# EAGLE design ライン_中央 (EAGLE 9.6.2)
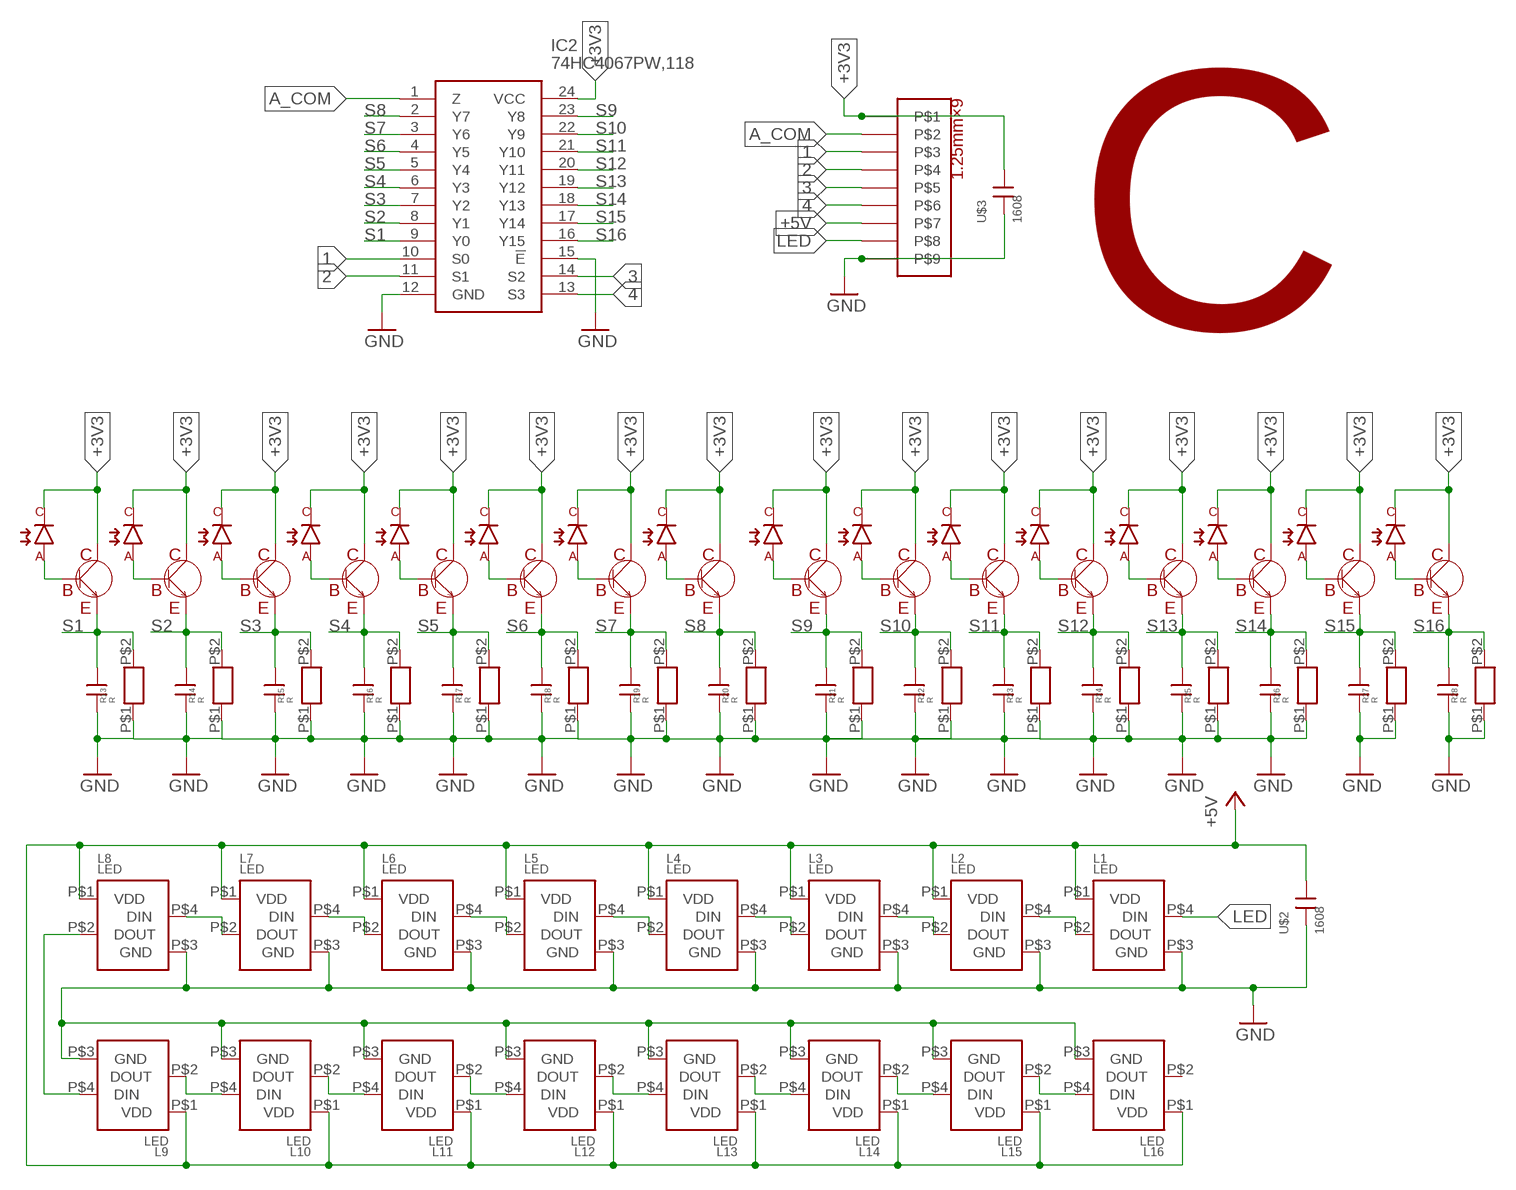
[diagram p0: schematic, sheet 1]

## Parts
C13  1608  [CON]
C14  1608  [CON]
C15  1608  [CON]
C16  1608  [CON]
C17  1608  [CON]
C18  1608  [CON]
C19  1608  [CON]
C20  1608  [CON]
C21  1608  [CON]
C22  1608  [CON]
C23  1608  [CON]
C24  1608  [CON]
C25  1608  [CON]
C26  1608  [CON]
C27  1608  [CON]
C28  1608  [CON]
IC2  74HC4067PW,118  [SOP65P640X110-24N]
L1  LED  [LED]
L2  LED  [LED]
L3  LED  [LED]
L4  LED  [LED]
L5  LED  [LED]
L6  LED  [LED]
L7  LED  [LED]
L8  LED  [LED]
L9  LED  [LED]
L10  LED  [LED]
L11  LED  [LED]
L12  LED  [LED]
L13  LED  [LED]
L14  LED  [LED]
L15  LED  [LED]
L16  LED  [LED]
P1  フォトダイオード  [フォトダイオード]
P2  フォトダイオード  [フォトダイオード]
P3  フォトダイオード  [フォトダイオード]
P4  フォトダイオード  [フォトダイオード]
P5  フォトダイオード  [フォトダイオード]
P6  フォトダイオード  [フォトダイオード]
P7  フォトダイオード  [フォトダイオード]
P8  フォトダイオード  [フォトダイオード]
P9  フォトダイオード  [フォトダイオード]
P10  フォトダイオード  [フォトダイオード]
P11  フォトダイオード  [フォトダイオード]
P12  フォトダイオード  [フォトダイオード]
P13  フォトダイオード  [フォトダイオード]
P14  フォトダイオード  [フォトダイオード]
P15  フォトダイオード  [フォトダイオード]
P16  フォトダイオード  [フォトダイオード]
R13  R  [1608]
R14  R  [1608]
R15  R  [1608]
R16  R  [1608]
R17  R  [1608]
R18  R  [1608]
R19  R  [1608]
R20  R  [1608]
R21  R  [1608]
R22  R  [1608]
R23  R  [1608]
R24  R  [1608]
R25  R  [1608]
R26  R  [1608]
R27  R  [1608]
R28  R  [1608]
T1  2CS2712  [TRANS_SSM3J325F,LF]
T2  2CS2712  [TRANS_SSM3J325F,LF]
T3  2CS2712  [TRANS_SSM3J325F,LF]
T4  2CS2712  [TRANS_SSM3J325F,LF]
T5  2CS2712  [TRANS_SSM3J325F,LF]
T6  2CS2712  [TRANS_SSM3J325F,LF]
T7  2CS2712  [TRANS_SSM3J325F,LF]
T8  2CS2712  [TRANS_SSM3J325F,LF]
T9  2CS2712  [TRANS_SSM3J325F,LF]
T10  2CS2712  [TRANS_SSM3J325F,LF]
T11  2CS2712  [TRANS_SSM3J325F,LF]
T12  2CS2712  [TRANS_SSM3J325F,LF]
T13  2CS2712  [TRANS_SSM3J325F,LF]
T14  2CS2712  [TRANS_SSM3J325F,LF]
T15  2CS2712  [TRANS_SSM3J325F,LF]
T16  2CS2712  [TRANS_SSM3J325F,LF]
U$1  1MMCON  [1MMCON]
U$2  1608  [CON]
U$3  1608  [CON]

## Nets
1: IC2.10(S0) U$1.P$3
2: IC2.11(S1) U$1.P$4
3: IC2.14(S2) U$1.P$5
4: IC2.13(S3) U$1.P$6
+3V3 [New Class]: IC2.24(VCC) P1.C P2.C P3.C P4.C P5.C P6.C P7.C P8.C P9.C P10.C P11.C P12.C P13.C P14.C P15.C P16.C T1.C T2.C T3.C T4.C T5.C T6.C T7.C T8.C T9.C T10.C T11.C T12.C T13.C T14.C T15.C T16.C U$1.P$1 U$3.P$1
+5V [New Class]: L1.P$1(VDD) L2.P$1(VDD) L3.P$1(VDD) L4.P$1(VDD) L5.P$1(VDD) L6.P$1(VDD) L7.P$1(VDD) L8.P$1(VDD) L9.P$1(VDD) L10.P$1(VDD) L11.P$1(VDD) L12.P$1(VDD) L13.P$1(VDD) L14.P$1(VDD) L15.P$1(VDD) L16.P$1(VDD) U$1.P$7 U$2.P$1
A_COM: IC2.1(Z) U$1.P$2
GND [New Class]: C13.P$2 C14.P$2 C15.P$2 C16.P$2 C17.P$2 C18.P$2 C19.P$2 C20.P$2 C21.P$2 C22.P$2 C23.P$2 C24.P$2 C25.P$2 C26.P$2 C27.P$2 C28.P$2 IC2.12(GND) IC2.15(!E) L1.P$3(GND) L2.P$3(GND) L3.P$3(GND) L4.P$3(GND) L5.P$3(GND) L6.P$3(GND) L7.P$3(GND) L8.P$3(GND) L9.P$3(GND) L10.P$3(GND) L11.P$3(GND) L12.P$3(GND) L13.P$3(GND) L14.P$3(GND) L15.P$3(GND) L16.P$3(GND) R13.P$1 R14.P$1 R15.P$1 R16.P$1 R17.P$1 R18.P$1 R19.P$1 R20.P$1 R21.P$1 R22.P$1 R23.P$1 R24.P$1 R25.P$1 R26.P$1 R27.P$1 R28.P$1 U$1.P$9 U$2.P$2 U$3.P$2
LED: L1.P$4(DIN) U$1.P$8
N$9: P1.A T1.B
N$10: P2.A T2.B
N$11: P3.A T3.B
N$12: P4.A T4.B
N$13: P5.A T5.B
N$14: P6.A T6.B
N$15: P7.A T7.B
N$23: P8.A T8.B
N$24: P9.A T9.B
N$25: P10.A T10.B
N$26: P11.A T11.B
N$27: P12.A T12.B
N$28: P13.A T13.B
N$29: P14.A T14.B
N$30: P15.A T15.B
N$31: P16.A T16.B
N$132: L15.P$2(DOUT) L16.P$4(DIN)
N$133: L14.P$2(DOUT) L15.P$4(DIN)
N$134: L11.P$2(DOUT) L12.P$4(DIN)
N$135: L10.P$2(DOUT) L11.P$4(DIN)
N$136: L9.P$2(DOUT) L10.P$4(DIN)
N$137: L13.P$2(DOUT) L14.P$4(DIN)
N$138: L12.P$2(DOUT) L13.P$4(DIN)
N$139: L7.P$2(DOUT) L8.P$4(DIN)
N$140: L6.P$2(DOUT) L7.P$4(DIN)
N$141: L3.P$2(DOUT) L4.P$4(DIN)
N$142: L2.P$2(DOUT) L3.P$4(DIN)
N$143: L1.P$2(DOUT) L2.P$4(DIN)
N$144: L5.P$2(DOUT) L6.P$4(DIN)
N$145: L4.P$2(DOUT) L5.P$4(DIN)
N$148: L8.P$2(DOUT) L9.P$4(DIN)
S1: C13.P$1 IC2.9(Y0) R13.P$2 T1.E
S2: C14.P$1 IC2.8(Y1) R14.P$2 T2.E
S3: C15.P$1 IC2.7(Y2) R15.P$2 T3.E
S4: C16.P$1 IC2.6(Y3) R16.P$2 T4.E
S5: C17.P$1 IC2.5(Y4) R17.P$2 T5.E
S6: C18.P$1 IC2.4(Y5) R18.P$2 T6.E
S7: C19.P$1 IC2.3(Y6) R19.P$2 T7.E
S8: C20.P$1 IC2.2(Y7) R20.P$2 T8.E
S9: C21.P$1 IC2.23(Y8) R21.P$2 T9.E
S10: C22.P$1 IC2.22(Y9) R22.P$2 T10.E
S11: C23.P$1 IC2.21(Y10) R23.P$2 T11.E
S12: C24.P$1 IC2.20(Y11) R24.P$2 T12.E
S13: C25.P$1 IC2.19(Y12) R25.P$2 T13.E
S14: C26.P$1 IC2.18(Y13) R26.P$2 T14.E
S15: C27.P$1 IC2.17(Y14) R27.P$2 T15.E
S16: C28.P$1 IC2.16(Y15) R28.P$2 T16.E
Unconnected: L16.P$2(DOUT)

## Notes on the sheet
- C

## Library data of the parts
C13-C28 U$2 U$3 = con1608:1608
IC2 = 16ch MUX:74HC4067PW,118: 74HC(T)4067 - 16-channel analog multiplexer/demultiplexer@en-us Source: Datasheet <https://assets.nexperia.com/documents/data-sheet/74HC_HCT4067.pdf>; DESCRIPTION: 74HC(T)4067 - 16-channel analog multiplexer/demultiplexer@en-us; HEIGHT: 1.1mm; MANUFACTURER_NAME: Nexperia; MANUFACTURER_PART_NUMBER: 74HC4067PW,118; MOUSER_PART_NUMBER: 771-74HC4067PW-T; MOUSER_PRICE-STOCK: https://www.mouser.co.uk/ProductDetail/Nexperia/74HC4067PW118?qs=P62ublwmbi9BArRi%252BuDUjA%3D%3D
L1-L16 = フルカラーLED:LED
P1-P16 = フォトダイオード:フォトダイオード
R13-R28 = R 1608:R
T1-T16 = 2CS2712:2CS2712
U$1 = 9P_1.25mmCON:1MMCON

## Net classes
1 New Class: width 0.33 mm

## Board
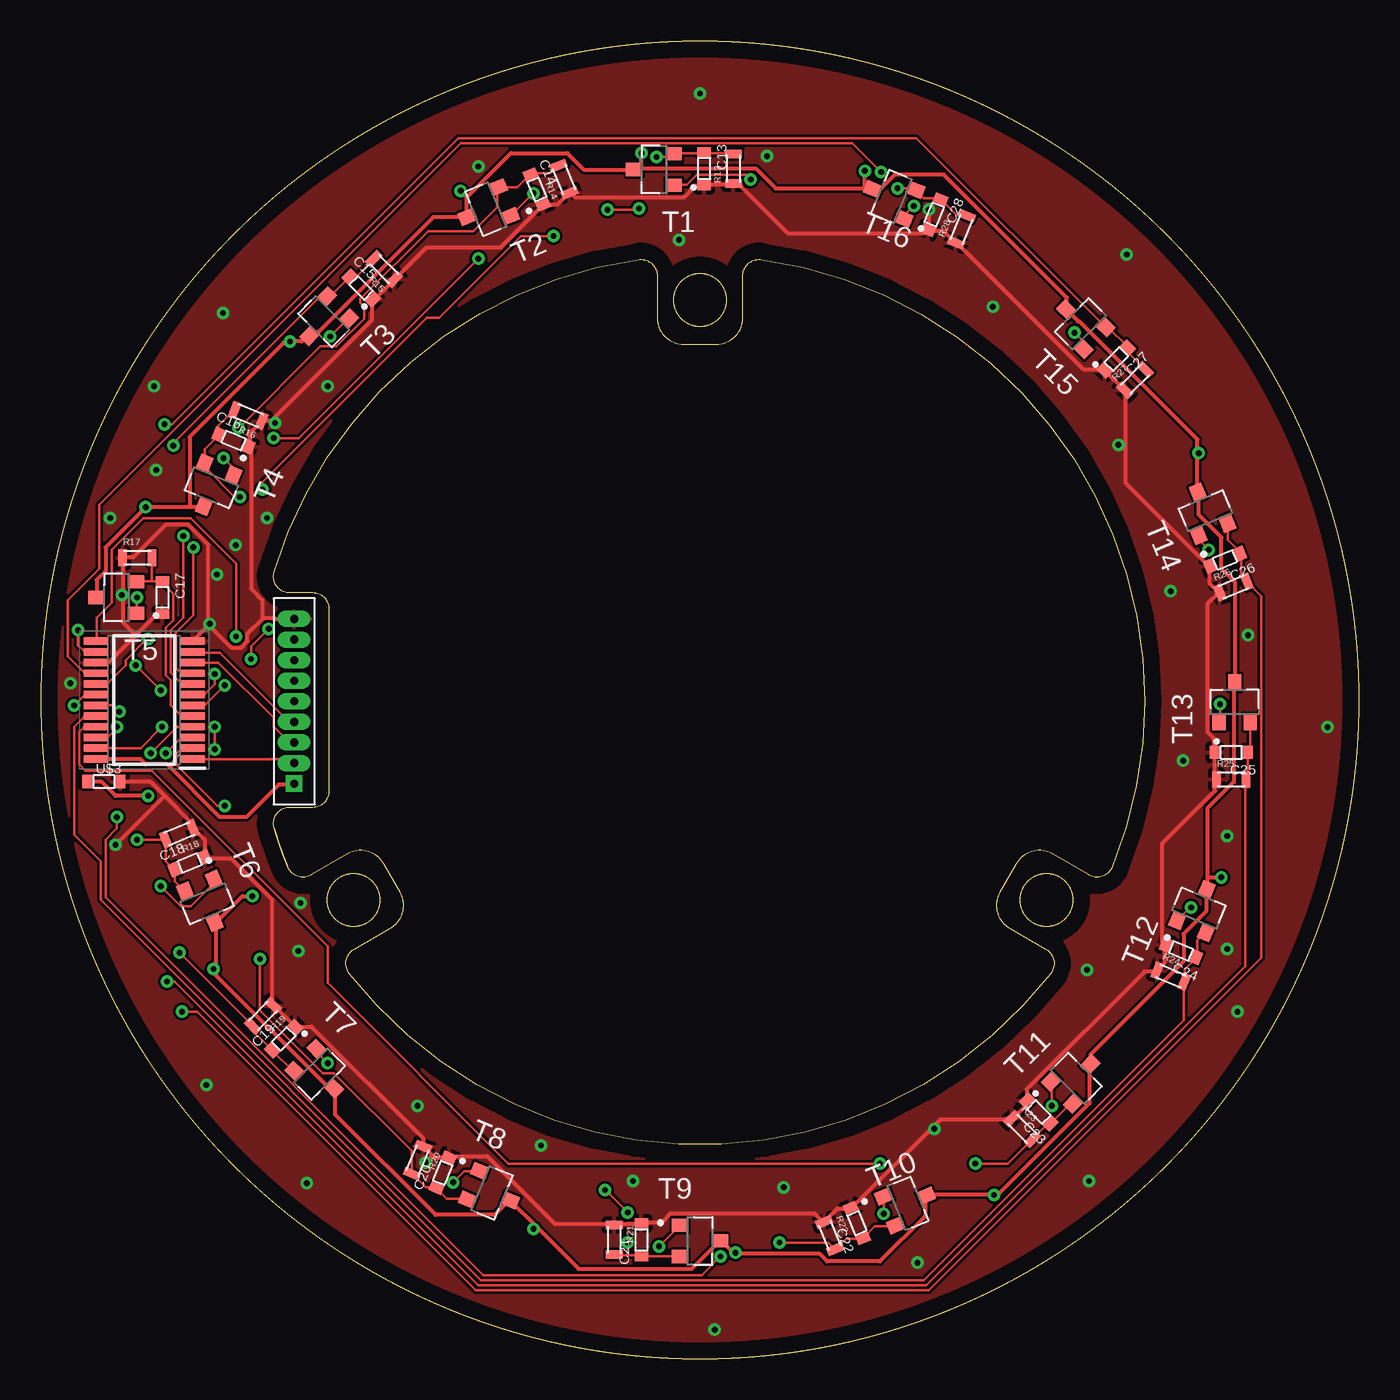
[diagram p1: board, top side]
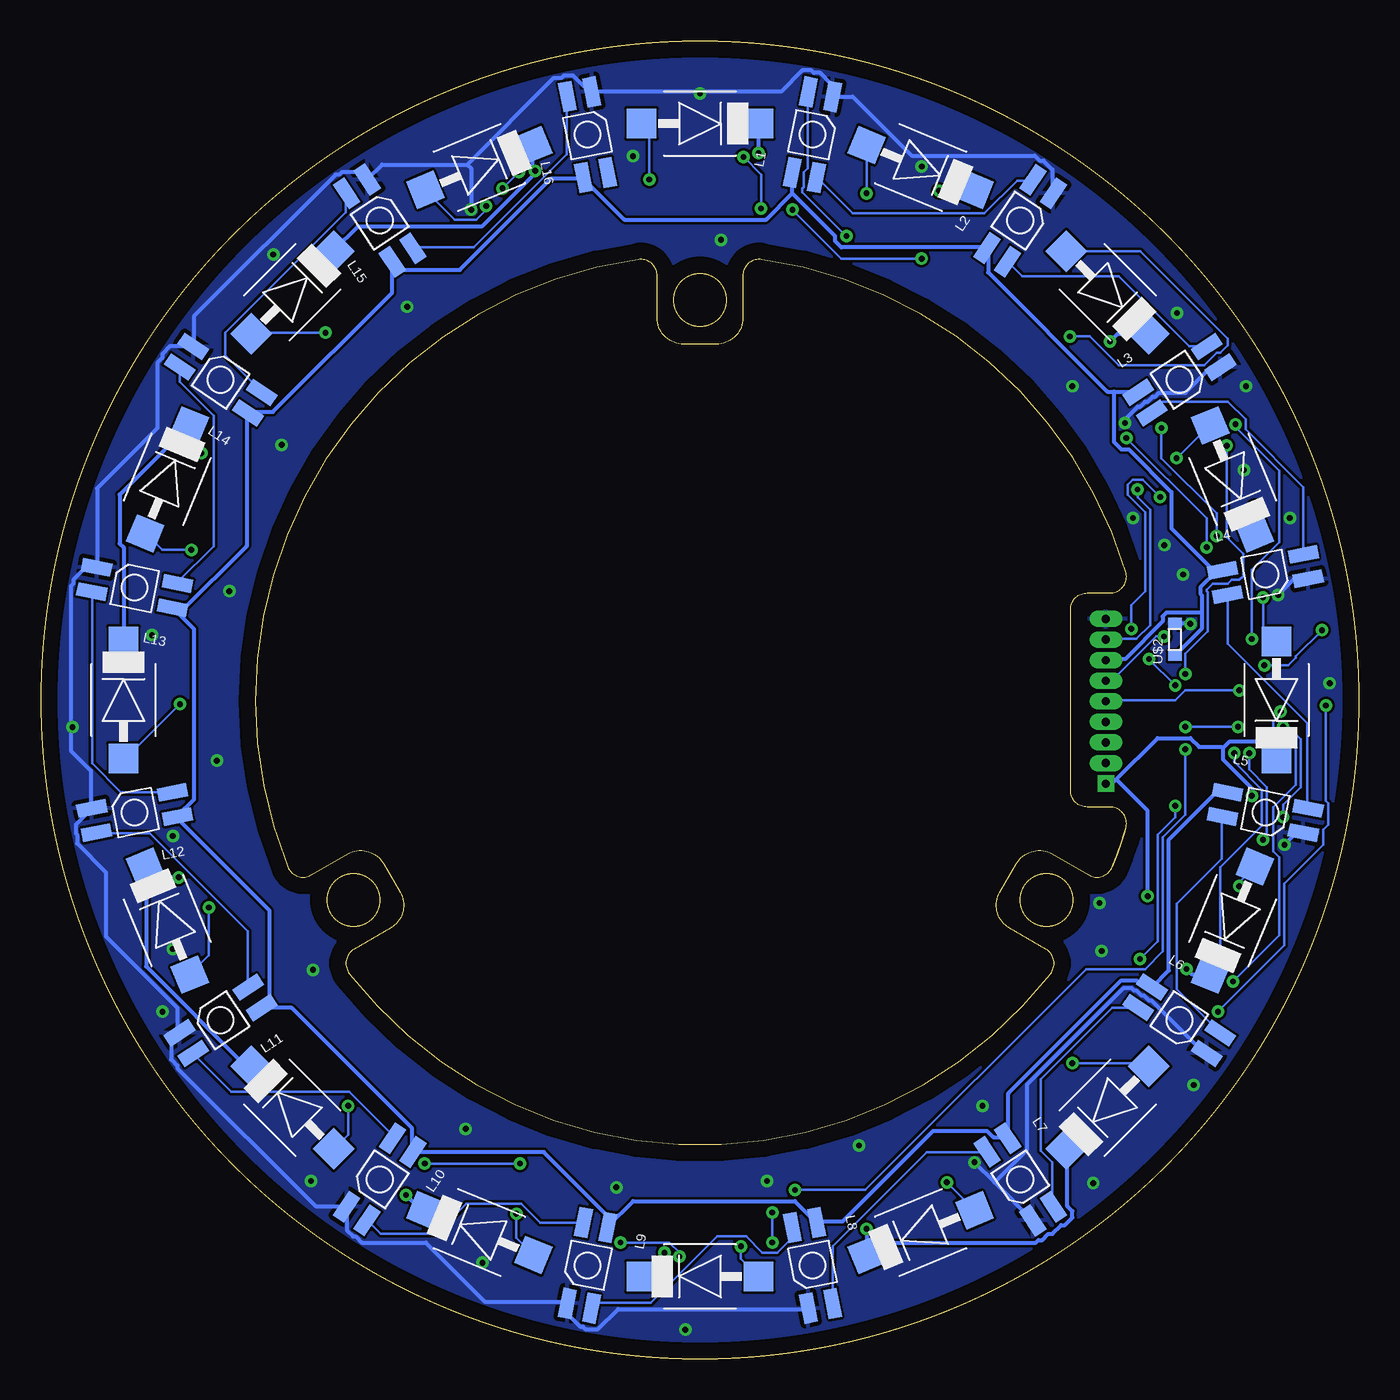
[diagram p2: board, bottom side, seen from below]

Size 80 x 80 mm. Coordinates in mm from the lower left corner, seen from the top.
Outline: 14.97,29.87 arc98 16.4,29.38 18.61,30.65 arc-90 20.79,30.07 21.79,28.33 arc-90 21.21,26.15 19,24.87 arc98 18.71,23.39 arc104 61.29,23.39 arc98 61,24.87 58.79,26.15 arc-90 58.21,28.33 59.21,30.07 arc-90 61.39,30.65 63.6,29.38 arc98 65.03,29.87 arc104 43.74,66.74 arc98 42.6,65.75 42.6,63.2 arc-90 41,61.6 39,61.6 arc-90 37.4,63.2 37.4,65.75 arc98 36.26,66.74 arc65 14.15,47.79 arc107 15.11,46.5 16.5,46.5 arc-90 17.5,45.5 17.5,34.5 arc-90 16.5,33.5 15.11,33.5 arc107 14.15,32.21
Outline: 14.97,29.87 arc-5 14.15,32.21
Outline: 14.15,32.21 arc5 14.97,29.87
Outline: circle at 40,64.3 radius 1.6
Outline: circle at 18.96,27.85 radius 1.6
Outline: circle at 61.04,27.85 radius 1.6
Outline: circle at 40,40 radius 40
Copper layers (1*16): Top 0.035mm / dielectric 1.5mm / Bottom 0.035mm
Design rules "default": minimum track width 6mil, minimum drill 0.35mm, track to track 6mil, track to pad 6mil, pad to pad 6mil, via to via 6mil, smd to smd 6mil, copper to edge 40mil, drill to drill 6mil, minimum pad ring 10mil, minimum via ring 8mil, stop-mask expansion 4mil, vias tented up to drill 0mil, thermal gap 10mil

### Footprints (pad centres in the part's own frame; a part is rotated, then mirrored left to right if it is on the bottom)
CON = smd 0.6 x 0.813: P$1 -1,0; P$2 1,0
SOP65P640X110-24N = smd 1.475 x 0.45: 1 -2.938,3.575; 2 -2.938,2.925; 3 -2.938,2.275; 4 -2.938,1.625; 5 -2.938,0.975; 6 -2.938,0.325; 7 -2.938,-0.325; 8 -2.938,-0.975; 9 -2.938,-1.625; 10 -2.938,-2.275; 11 -2.938,-2.925; 12 -2.938,-3.575; 13 2.938,-3.575; 14 2.938,-2.925; 15 2.938,-2.275; 16 2.938,-1.625; 17 2.938,-0.975; 18 2.938,-0.325; 19 2.938,0.325; 20 2.938,0.975; 21 2.938,1.625; 22 2.938,2.275; 23 2.938,2.925; 24 2.938,3.575
LED = smd 1.8 x 0.82: P$1 -2.5,0.75; P$2 -2.5,-0.75; P$3 2.5,-0.75; P$4 2.5,0.75
フォトダイオード = smd 1.8 x 1.8: A -3.55,0; C 3.55,0
1608 = smd 0.508 x 1.016: P$1 -0.889,0; P$2 0.889,0
TRANS_SSM3J325F,LF = smd 1 x 0.8: B -1.2,0.95; C 1.2,0; E -1.2,-0.95
1MMCON = drill 0.5 square: P$1 0,0 | drill 0.5 long: P$2 1.25,0; P$3 2.5,0; P$4 3.75,0; P$5 5,0; P$6 6.25,0; P$7 7.5,0; P$8 8.75,0; P$9 10,0

### Placement (x,y rotation side)
C13  40.25,72.26 270 top
C14  30.09,70.99 292.5 top
C15  19.43,65.02 315 top
C16  11.68,55.75 337.5 top
C17  7.36,46.22 270 top
C18  9.01,30.09 22.5 top
C19  14.73,19.43 45 top
C20  24.38,11.3 67.5 top
C21  36.44,7.23 90 top
C22  49.52,8.25 112.5 top
C23  60.57,14.98 135 top
C24  69.21,24.76 157.5 top
C25  72.26,36.83 180 top
C26  71.88,48.51 202.5 top
C27  65.27,60.7 225 top
C28  54.22,69.46 247.5 top
IC2  6.25,40 180 top
L1  33.17,74.33 78.7 bottom
L2  20.56,69.1 56.2 bottom
L3  10.9,59.44 33.7 bottom
L4  5.67,47.62 11.2 bottom
L5  5.67,33.17 348.7 bottom
L6  10.9,20.56 326.2 bottom
L7  20.56,10.9 303.7 bottom
L8  33.17,5.67 281.2 bottom
L9  46.83,5.67 258.7 bottom
L10  59.44,10.9 236.2 bottom
L11  69.1,20.56 213.7 bottom
L12  74.33,33.17 191.2 bottom
L13  74.33,46.83 168.7 bottom
L14  69.1,59.44 146.2 bottom
L15  59.44,69.1 123.7 bottom
L16  46.83,74.33 101.2 bottom
P1  40,75 0 bottom
P2  26.61,72.34 337.5 bottom
P3  15.25,64.75 315 bottom
P4  7.66,53.39 292.5 bottom
P5  5,40 270 bottom
P6  7.66,26.61 247.5 bottom
P7  15.25,15.25 225 bottom
P8  26.61,7.66 202.5 bottom
P9  40,5 180 bottom
P10  53.39,7.66 157.5 bottom
P11  64.75,15.25 135 bottom
P12  72.34,26.61 112.5 bottom
P13  75,40 90 bottom
P14  72.34,53.39 67.5 bottom
P15  64.75,64.75 45 bottom
P16  53.39,72.34 22.5 bottom
R13  42.03,72.26 90 top
R14  31.74,71.62 112.5 top
R15  20.82,66.16 135 top
R16  12.57,57.27 157.5 top
R17  5.84,48.64 0 top
R18  8.38,31.87 202.5 top
R19  13.46,20.82 225 top
R20  22.86,12.06 247.5 top
R21  34.79,7.23 270 top
R22  47.87,7.49 292.5 top
R23  59.56,13.96 315 top
R24  68.58,23.24 337.5 top
R25  72.26,35.17 0 top
R26  72.38,46.86 22.5 top
R27  66.42,59.43 45 top
R28  55.88,68.58 67.5 top
T1  37.21,72.21 180 top
T2  26.99,69.8 202.5 top
T3  17.16,62.97 225 top
T4  10.33,52.88 247.5 top
T5  4.57,46.22 180 top
T6  10.08,27.62 292.5 top
T7  16.9,17.28 315 top
T8  27.37,10.08 337.5 top
T9  40,7.16 0 top
T10  52.63,9.44 22.5 top
T11  62.84,17.03 45 top
T12  70.3,27.37 67.5 top
T13  72.46,39.87 90 top
T14  70.68,51.49 112.5 top
T15  63.1,62.84 135 top
T16  51.62,70.56 157.5 top
U$1  15.36,34.92 90 top
U$2  11.17,43.68 90 bottom
U$3  3.8,35.05 0 top

### Tracks (layer width: path | path; a pad name or v marks a point on that pad's centre or on a via)
1
  Top 0.152: IC2.10 9.24,42.26 10.77,42.26 14.12,38.91 14.12,38.37 15.03,37.46 15.34,37.46 U$1.P$3
2
  Top 0.152: IC2.11 9.24,42.87 10.84,42.87 15.03,38.68 15.34,38.68 U$1.P$4
3  (via drill 0.35)
  Top 0.152: v2.23,44.24 2.23,43.33 2.61,42.95 3.3,42.95 IC2.14 | v7.26,40.58 v5.73,42.11
  Bottom 0.152: v2.23,44.24 3.83,42.64 3.83,42.56 4.29,42.11 v5.73,42.11 | v7.26,40.58 10.54,40.58 11.15,39.98 15.34,39.98 U$1.P$5
4  (via drill 0.35)
  Top 0.152: v11.83,43.86 11.83,48.28 9.09,51.02 6.19,51.02 4.29,49.12 4.29,45.92 3.37,45 3.37,43.63 IC2.13
  Bottom 0.152: v11.83,43.86 12.29,43.86 14.96,41.19 15.34,41.19 U$1.P$6
+3V3  (via drill 0.35)
  Top 0.254: 9.01,51.71 9.85,51.71 T4.C | 9.01,51.71 v6.34,51.71 3.91,49.27 3.91,47.82 3.37,47.29 T5.C | 25.85,70.53 28.52,73.2 31.95,73.2 32.94,72.21 35.99,72.21 T1.C | 25.85,70.53 25.85,69.46 T2.C 25.85,69.31 23.8,69.31 16.63,62.15 16.33,62.15 T3.C 16.18,62.15 15.79,61.77 v15.11,61.77 15.03,61.69 14.73,61.69 9.01,55.98 9.01,51.71 | 50.01,71.06 44.6,71.06 43.38,72.28 36.06,72.28 T1.C | 50.01,71.06 50.47,71.06 T16.C 50.62,71.06 51,71.06 51.84,71.9 54.81,71.9 62.28,64.44 62.28,63.83 T15.C 62.28,63.67 62.96,62.99 63.04,62.99 70.2,55.82 70.2,54.99 | 25.85,70.53 v25.47,70.91 | v36.44,73.2 36.44,72.36 T1.C | 50.01,71.06 v50.01,72.13 | v6.5,34.18 4.52,34.18 3.68,35.02 2.84,35.02 U$3.P$1 | IC2.24 3.37,36.39 6.04,36.39 6.34,36.09 7.64,36.09 10.84,32.89 12.44,32.89 14.42,34.87 15.34,34.87 U$1.P$1 | 10.61,23.67 10.61,26.49 T6.C 10.69,26.56 12.21,28.09 v12.82,28.09 | 10.61,23.67 10.61,23.29 17.39,16.5 17.7,16.5 T7.C 17.85,16.35 17.85,14.83 23.95,8.73 27.53,8.73 28.37,9.57 T8.C 28.52,9.57 30.04,8.05 | v10.46,23.67 10.61,23.67 | 30.04,8.05 32.63,5.46 39.49,5.46 41.17,7.13 T9.C 41.32,7.13 42.01,6.45 v42.16,6.45 42.23,6.37 47.26,6.37 47.72,5.91 50.92,5.91 53.66,8.66 53.66,9.8 T10.C 53.74,9.95 v57.86,9.95 58.09,9.95 63.65,15.51 63.65,17.88 T11.C 63.72,17.95 63.72,18.49 69.36,24.12 69.36,25.8 70.73,27.17 70.73,28.39 T12.C 70.81,28.55 70.81,29.23 | v29.89,7.89 30.04,8.05 | 70.81,29.23 70.81,33.42 72.41,35.02 72.41,41.04 T13.C 72.49,41.19 72.49,47.14 71.65,47.98 71.65,49.88 70.28,51.25 70.28,52.55 T14.C 70.2,52.7 70.2,54.99 | v70.28,54.99 70.2,54.99 | 70.81,29.23 v71.65,29.23
  Bottom 0.254: 50.16,72.13 50.16,71.83 53.21,68.78 60.75,68.78 62.2,67.33 P15.C | 50.16,72.13 50.16,73.66 P16.C | v6.34,51.71 6.34,50.19 P4.C | v15.11,61.77 14.65,62.23 12.75,62.23 P3.C | v25.47,70.91 23.34,70.91 P2.C | v36.44,73.2 36.44,74.95 P1.C | v50.01,72.13 50.16,72.13 | v6.5,34.18 6.5,34.64 8.25,36.39 8.25,37.08 | 8.25,37.08 7.87,37.46 6.04,37.46 5.05,36.47 P5.C | 14.73,35.17 14.96,34.95 15.34,34.95 U$1.P$1 | 14.73,35.17 12.21,37.69 10.23,37.69 9.7,37.16 8.33,37.16 8.25,37.08 | v10.46,23.67 10.16,23.36 9.09,23.36 P6.C | 14.73,35.17 12.82,33.27 v12.82,28.09 | v42.16,6.45 43.53,5.08 P9.C | v29.89,7.89 29.89,6.37 P8.C 29.81,7.06 19.6,7.06 19.45,7.21 19.22,7.21 18.84,7.59 18.61,7.59 18.08,8.12 17.85,8.12 17.39,8.58 17.39,8.96 17.7,9.27 17.7,12.7 P7.C | P11.C 67.31,17.8 67.61,17.8 73.63,23.82 73.63,29.84 P12.C 73.55,29.23 v71.65,29.23 | P13.C 75,49.27 75.23,49.5 75.23,52.47 71.04,56.66 P14.C 71.42,56.13 v70.28,54.99 | v57.86,9.95 56.94,9.04 56.71,9.04 P10.C
+5V
  Bottom 0.254: L5.P$1 8.02,34.34 8.71,34.34 11.53,31.52 11.53,23.59 12.52,22.6 L6.P$1 12.67,22.6 13.13,22.6 13.51,22.98 14.42,22.98 21.28,16.12 21.28,13.53 L7.P$1 21.36,13.46 22.2,13.46 22.58,13.84 25.85,13.84 31.34,8.35 32.86,8.35 L8.P$1 32.94,8.27 34.23,9.57 44.06,9.57 45.59,8.05 L9.P$1 45.36,8.43 49.47,12.54 57.4,12.54 L10.P$1 57.48,12.62 57.48,13.99 64.79,21.31 66.54,21.31 L11.P$1 66.16,21.38 66.16,27.25 71.72,32.81 L12.P$1 71.72,32.96 70.73,33.95 70.73,44.32 71.95,45.54 L13.P$1 71.57,45.31 67.53,49.35 67.53,57.35 L14.P$1 67.38,57.5 65.93,57.5 58.69,64.74 58.69,66.57 L15.P$1 58.62,66.11 54.58,66.11 49.02,71.67 47.11,71.67 L16.P$1 47.04,71.6 44.6,69.16 35.99,69.16 34.39,70.76 | 9.55,45.31 9.55,46.38 9.62,46.45 9.62,46.83 8.63,47.82 8.33,47.82 L4.P$1 8.78,47.82 11.37,50.41 11.37,52.62 13.96,55.22 14.42,55.22 14.88,55.67 14.88,58.72 | 9.55,45.31 9.55,44.32 11.15,42.72 U$2.P$1 | 9.55,45.31 11.68,45.31 11.91,45.08 11.91,44.77 14.19,42.49 15.34,42.49 U$1.P$7 | 14.88,58.72 15.26,58.72 22.5,65.96 22.5,67.41 L2.P$1 22.65,67.48 31.41,67.48 31.8,67.86 31.8,68.17 34.39,70.76 | 14.88,58.72 13.43,58.72 L3.P$1 | 34.39,70.76 34.39,71.98 L1.P$1
A_COM
  Top 0.152: IC2.1 9.24,36.39 15.18,36.39 15.34,36.24 U$1.P$2
GND  (via drill 0.35)
  Top 0.254: 7.49,34.18 9.09,32.58 9.09,32.28 R18.P$1 9.24,32.2 9.93,31.52 9.93,30.53 C18.P$2 10,30.37 11.53,30.37 14.04,27.86 14.04,21.53 R19.P$1 14.12,21.46 15.41,20.16 C19.P$2 15.57,20.16 16.4,20.16 23.18,13.38 23.18,13 R20.P$1 23.26,12.85 23.76,12.35 | 7.49,34.18 6.65,35.02 4.82,35.02 U$3.P$2 | 7.49,34.18 v4.52,31.21 | 23.76,12.35 23.87,12.24 24.71,12.24 C20.P$2 24.79,12.31 27.07,12.31 31.19,8.2 34.69,8.2 R21.P$1 34.84,8.12 34.92,8.2 36.44,8.2 C21.P$2 36.52,8.27 37.66,8.27 38.2,8.81 46.96,8.81 47.42,8.35 R22.P$1 47.57,8.35 48.33,9.11 49.09,9.11 C22.P$2 49.25,9.19 54.58,14.52 58.85,14.52 R23.P$1 59,14.6 59.84,15.44 59.84,15.67 C23.P$2 59.84,15.82 59.84,16.35 67,23.52 67.69,23.52 R24.P$1 67.76,23.59 68.22,24.05 68.22,25.12 C24.P$2 68.14,25.19 68.07,25.27 68.07,31.29 71.27,34.49 71.27,35.1 R25.P$1 71.34,35.17 71.27,35.25 71.27,36.77 C25.P$2 71.19,36.93 71.19,37.69 70.81,38.07 70.81,45.84 71.42,46.45 R26.P$1 71.5,46.53 70.96,47.06 70.96,48.05 C26.P$2 70.89,48.13 65.86,53.16 65.86,58.72 R27.P$1 64.64,59.94 C27.P$2 64.49,60.09 63.27,60.09 55.65,67.71 R28.P$1 55.49,67.79 54.81,68.47 53.89,68.47 C28.P$2 | 23.76,12.35 v23.34,11.93 | 5.73,43.94 4.13,42.34 3.37,42.34 IC2.15 | 5.73,43.94 6.95,45.16 7.34,45.16 C17.P$2 | 4.97,46.38 4.97,44.7 5.73,43.94 | 4.97,46.38 4.97,48.59 R17.P$1 5.05,48.66 5.58,48.66 7.56,50.64 8.94,50.64 10.16,49.42 10.16,44.7 v10.23,44.62 | v4.9,46.38 4.97,46.38 | v10.23,44.62 9.24,43.63 IC2.12 | 13.51,45 14.12,45 14.19,44.93 15.34,44.93 U$1.P$9 | 13.51,45 12.52,44.01 12.52,43.56 12.14,43.17 11.53,43.17 10.23,44.47 v10.23,44.62
  Top 0.254: 13.96,56.97 13.51,56.97 R16.P$1 13.36,56.89 12.67,56.2 12.67,55.37 C16.P$2 12.75,55.29 12.75,46.76 13.43,46.07 13.43,45.08 13.51,45 | 13.96,56.97 20.06,63.06 20.06,64.21 C15.P$2 20.14,64.36 20.29,64.36 21.43,65.5 R15.P$1 21.51,65.58 23.41,67.48 27.91,67.48 30.42,70 C14.P$2 30.5,70.07 31.34,70.07 32.02,70.76 R14.P$1 32.18,70.76 32.41,70.53 39.03,70.53 39.72,71.22 40.18,71.22 C13.P$2 40.25,71.29 41.93,71.29 42.01,71.37 R13.P$1 42.08,71.29 42.39,71.29 45.36,68.32 53.59,68.32 53.74,68.47 C28.P$2 | v14.19,56.81 14.04,56.97 13.96,56.97 | v53.89,69.77 53.89,68.63 C28.P$2
  Bottom 0.254: v4.52,31.21 3.83,31.9 3.37,31.9 L5.P$3 | v23.34,11.93 22.12,10.71 | 22.12,10.71 19.83,8.43 L7.P$3 | 22.12,10.71 20.14,12.7 20.14,16.66 14.27,22.52 13.81,22.52 13.66,22.37 13.51,22.37 13.2,22.07 13.05,22.07 12.75,21.76 12.59,21.76 9.39,18.56 9.24,18.56 L6.P$3 | v4.9,46.38 3.91,47.37 3.15,47.37 L4.P$3 | v10.23,44.62 11.15,44.62 U$2.P$2 | v14.19,56.81 14.19,57.04 13.43,57.8 13.28,57.8 12.97,58.11 12.82,58.11 12.52,58.41 12.36,58.41 12.14,58.64 10.54,58.64 9.01,60.17 8.48,60.17 L3.P$3 | L8.P$3 33.47,3.02 44.98,3.02 46.2,1.8 46.96,1.8 47.11,1.95 47.26,1.95 48.03,2.71 48.03,3.32 L9.P$3 48.1,3.48 53.06,3.48 56.64,7.06 60.52,7.06 60.9,7.44 61.06,7.44 61.44,7.82 61.44,9.11 L10.P$3 61.51,9.27 63.34,9.27 71.72,17.65 71.72,17.8 72.11,18.18 72.11,19.32 71.65,19.78 L11.P$3 71.72,19.86 71.72,21.31 76.07,25.65 76.07,29.54 77.82,31.29 77.82,31.82 77.9,31.9 77.9,32.43 76.98,33.34 L12.P$3 76.98,33.5 76.98,35.71 78.2,36.93 78.2,46.91 78.05,47.06 78.05,47.29 77.29,48.05 76.68,48.05 L13.P$3 76.6,48.13 76.6,52.85 72.94,56.51 72.94,60.47 72.64,60.78 72.64,61.01 72.18,61.46 70.89,61.46 L14.P$3 70.73,61.46 70.73,63.29 62.12,71.9 61.89,71.9 61.74,72.06 60.68,72.06 L15.P$3 60.14,71.67 59.3,72.51 54.12,72.51 | L2.P$3 18.61,70.84 18.61,72.21 19.15,72.74 19.38,72.74 19.68,73.05 27.15,73.05 30.73,76.63 31.87,76.63 L1.P$3 32.02,76.7 32.02,77.39 32.71,78.08 33.09,78.08 33.24,78.23 33.78,78.23 35.07,76.93 46.5,76.93 L16.P$3 46.66,77.01 46.81,77.01 47.72,77.92 48.26,77.92 48.41,77.77 48.87,77.77 54.12,72.51 | v53.89,69.77 53.89,72.28 54.12,72.51
  other vias: 40,76.83 26.54,72.38 44.06,73.02 65.91,67.05 57.78,63.88 65.4,55.49 68.58,46.6 69.34,36.32 78.1,38.35 63.5,23.62 72.64,21.08 72,24.89 72,31.74 73.27,43.94 53.21,5.84 54.22,13.96 45.08,10.41 63.62,10.79 40.89,1.77 35.94,10.79 30.35,12.95 16.12,10.66 22.86,15.36 15.62,24.76 10.03,16.63 10.66,47.62 1.77,41.02 15.74,27.68 38.73,67.94 17.39,59.05 11.04,63.5 6.85,59.05 11.81,49.4 13.71,51.05 4.19,51.05 6.98,53.97
  pour Bottom: -3.18,70.48 -6.99,66.67 arc310 41.27,84.45 arc44
  pour Top: 46.35,90.8 45.08,90.8 39.37,90.8 arc316 74.29,76.83 arc34
LED  (via drill 0.35)
  Top 0.152: v31.11,68.17 29.13,68.17 24.18,63.22 23.41,63.22 13.43,53.23 v13.43,52.78
  Bottom 0.152: v31.11,68.17 33.78,70.84 33.78,71.06 33.7,71.14 33.7,72.06 33.47,72.28 33.47,76.85 L1.P$4 | v13.43,52.78 13.43,52.32 12.67,51.56 12.67,44.55 13.51,43.71 15.34,43.71 U$1.P$8
N$9  (via drill 0.35)
  Top 0.152: v43.07,71.6 42.77,71.9 39.8,71.9 39.19,71.29 38.42,71.29 T1.B
  Bottom 0.152: v43.07,71.6 43.07,74.49 43.53,74.95 P1.A
N$10  (via drill 0.35)
  Top 0.152: v29.89,70.76 28.52,69.39 T2.B
  Bottom 0.152: v29.89,70.76 29.89,73.66 P2.A
N$11  (via drill 0.35)
  Top 0.152: v17.55,62.07 18.61,63.14 T3.B
  Bottom 0.152: v17.55,62.07 16.33,62.07 14.57,60.32 9.39,60.32 8.63,61.08 8.4,61.08 7.95,61.54 7.95,61.92 13.28,67.25 17.7,67.25 P3.A
N$12  (via drill 0.35)
  Top 0.152: v11.07,54.68 11.6,54.15 11.6,53.69 T4.B
  Bottom 0.152: v11.07,54.68 9.09,56.66 P4.A
N$13  (via drill 0.35)
  Top 0.152: v5.81,46.22 5.81,45.31 T5.B
  Bottom 0.152: v5.81,46.22 5.81,44.32 5.05,43.56 P5.A
N$14  (via drill 0.35)
  Top 0.152: v7.26,28.7 8.48,27.48 9.09,27.48 10.46,28.85 10.46,29.08 T6.B
  Bottom 0.152: v7.26,28.7 7.26,28.93 6.34,29.84 P6.A
N$15  (via drill 0.35)
  Top 0.152: v17.39,17.95 16.78,18.56 16.78,18.79 T7.B
  Bottom 0.152: v17.39,17.95 12.9,17.95 12.75,17.8 P7.A
N$23  (via drill 0.35)
  Top 0.152: v25.01,10.71 25.7,11.4 T8.B
  Bottom 0.152: v25.01,10.71 23.34,9.04 P8.A
N$24  (via drill 0.35)
  Top 0.152: v37.51,6.83 38.73,8.05 T9.B
  Bottom 0.152: v37.51,6.83 37.51,6.07 36.52,5.08 P9.A
N$25  (via drill 0.35)
  Top 0.152: v51.15,8.81 51.15,9.8 T10.B
  Bottom 0.152: v51.15,8.81 51.15,7.36 50.16,6.37 P10.A
N$26  (via drill 0.35)
  Top 0.152: v61.36,15.36 61.36,16.81 T11.B
  Bottom 0.152: v61.36,15.36 61.36,13.61 62.2,12.77 P11.A
N$27  (via drill 0.35)
  Top 0.152: v69.82,27.4 69.74,27.4 68.98,26.64 T12.B
  Bottom 0.152: v69.82,27.4 69.82,24.51 70.96,23.36 P12.A
N$28  (via drill 0.35)
  Top 0.152: v71.57,39.75 71.57,38.68 T13.B
  Bottom 0.152: v71.57,39.75 74.92,36.39 P13.A
N$29  (via drill 0.35)
  Top 0.152: v70.89,49.12 70.28,49.73 70.28,49.96 T14.B
  Bottom 0.152: v70.89,49.12 72.64,49.12 73.63,50.11 P14.A
N$30  (via drill 0.35)
  Top 0.152: v62.73,62.3 63.27,61.77 63.27,61.39 T15.B
  Bottom 0.152: v62.73,62.3 67.23,62.3 P15.A
N$31  (via drill 0.35)
  Top 0.152: v52.98,70 52.37,69.39 52.37,69.23 T16.B
  Bottom 0.152: v52.98,70 52.98,69.77 53.59,69.16 54.88,69.16 56.64,70.91 P16.A
N$132
  Bottom 0.152: L15.P$2 57.4,67.48 53.74,67.48 48.1,73.12 48.1,76.63 L16.P$4
N$133
  Bottom 0.152: L15.P$4 61.51,70.76 61.51,69.62 68.83,62.3 68.83,60.93 66.62,58.72 L14.P$2
N$134
  Bottom 0.152: L11.P$2 67.46,22.6 67.46,25.95 73.4,31.9 76.6,31.9 L12.P$4
N$135
  Bottom 0.152: L10.P$2 58.69,13.46 58.69,13.61 61.28,16.2 68.45,16.2 70.73,18.49 L11.P$4
N$136
  Bottom 0.152: L9.P$2 47.11,8.27 49.7,8.27 50.85,9.42 54.2,9.42 56.03,7.59 59.38,7.59 60.14,8.35 L10.P$4
N$137
  Bottom 0.152: L14.P$4 71.57,60.17 71.57,59.33 69.52,57.27 69.52,49.35 71.72,47.14 L13.P$2
N$138
  Bottom 0.152: L12.P$2 72.03,34.41 75.15,34.41 76.91,36.16 76.91,46.53 L13.P$4
N$139
  Bottom 0.152: L7.P$2 22.58,12.54 26.23,12.54 31.95,6.83 31.95,3.4 L8.P$4
N$140
  Bottom 0.152: L7.P$4 18.61,9.27 18.61,11.93 19.3,12.62 19.3,16.96 14.96,21.31 13.43,21.31 L6.P$2
N$141
  Bottom 0.152: L4.P$4 3.37,48.89 3.37,52.93 6.88,56.43 6.88,57.04 7.95,58.11 11.91,58.11 12.52,57.5 L3.P$2
N$142
  Bottom 0.152: L3.P$4 10.31,61.46 14.57,65.73 20.44,65.73 21.28,66.57 L2.P$2
N$143
  Bottom 0.152: L2.P$4 19.83,71.52 20.75,71.52 22.73,69.54 30.73,69.54 32.86,71.67 L1.P$2
N$144
  Bottom 0.152: L5.P$2 8.33,32.89 8.33,30.37 11.07,27.63 11.07,22.45 8.48,19.86 L6.P$4
N$145
  Bottom 0.152: L5.P$4 3.15,33.42 3.15,38.6 7.95,43.4 7.95,46.38 L4.P$2
N$148
  Bottom 0.152: L8.P$2 34.46,7.97 34.46,7.28 35.3,6.45 36.22,6.45 37.21,7.44 38.96,7.44 43,3.4 46.27,3.4 46.58,3.09 L9.P$4
S1  (via drill 0.35)
  Top 0.152: 40.25,73.2 42.01,73.2 R13.P$2 | 40.25,73.2 38.42,73.2 T1.E 38.35,73.12 38.2,72.97 v37.36,72.97 | 40.25,73.2 C13.P$1 | v9.24,49.27 9.24,45.16 8.17,44.09 8.17,41.96 8.48,41.65 9.16,41.65 IC2.9 | v14.12,55.9 15.64,55.9 v26.54,66.8 | v34.39,69.77 36.22,69.77 v36.29,69.84
  Bottom 0.152: v9.24,49.27 9.24,51.02 v14.12,55.9 | v26.54,66.8 31.41,66.8 v34.39,69.77 | v36.29,69.84 36.29,71.9 v37.36,72.97
S2  (via drill 0.35)
  Top 0.152: R14.P$2 31.34,72.44 30.88,71.98 29.74,71.98 C14.P$1 29.66,71.9 28.9,71.14 27.76,71.14 T2.E 27.68,71.06 27.68,69.92 26.23,68.47 23.49,68.47 19.38,64.36 19.38,64.13 19.6,63.9 19.6,63.14 17.93,61.46 16.94,61.46 v11.98,56.51 | v8.63,49.96 8.63,45 7.87,44.24 7.87,41.65 8.48,41.04 9.16,41.04 IC2.8
  Bottom 0.152: v8.63,49.96 8.63,51.33 11.98,54.68 v11.98,56.51
S3  (via drill 0.35)
  Top 0.152: R15.P$2 20.14,66.72 19.15,65.73 18.77,65.73 C15.P$1 18.69,65.65 17.55,64.51 17.39,64.51 T3.E 17.32,64.44 16.86,64.44 8.02,55.6 v8.02,55.44 | v10.54,41.58 10.54,40.97 9.93,40.36 9.24,40.36 IC2.7
  Bottom 0.152: v10.54,41.58 10.54,42.79 9.16,44.17 9.16,46.53 9.24,46.6 9.24,46.68 8.86,47.06 7.95,47.06 7.72,47.29 7.26,47.29 7.03,47.52 7.03,48.89 8.02,49.88 v8.02,55.44
S4  (via drill 0.35)
  Top 0.152: R16.P$2 11.68,57.58 10.77,56.66 10.77,56.2 C16.P$1 10.77,56.05 9.93,55.22 9.93,54.38 T4.E 9.93,54.3 9.93,54.15 11.75,52.32 v12.06,52.32 | v11.15,40.89 10,39.75 9.24,39.75 IC2.6 | v12.75,42.49 12.75,43.25 v13.81,44.32
  Bottom 0.152: v12.75,42.49 v11.15,40.89 | v13.81,44.32 13.81,45.77 12.97,46.6 12.97,51.41 14.04,52.47 14.04,53.08 13.74,53.39 13.13,53.39 v12.06,52.32
S5
  Top 0.152: 6.73,47.21 5.81,47.21 T5.E | 6.73,47.21 7.34,47.21 C17.P$1 7.34,47.14 8.02,46.45 8.02,44.85 7.56,44.39 7.56,41.5 7.87,41.19 7.87,39.67 8.48,39.06 9.16,39.06 IC2.5 | 6.73,47.21 R17.P$2
S6  (via drill 0.35)
  Top 0.152: T6.E 8.71,28.39 8.1,29 8.1,29.69 C18.P$1 8.02,29.76 7.56,30.22 7.56,31.52 R18.P$2 7.49,31.52 v5.81,31.52 | v6.65,36.77 8.25,38.37 9.16,38.37 IC2.4
  Bottom 0.152: v6.65,36.77 6.65,35.78 5.58,34.72 5.58,31.74 v5.81,31.52
S7  (via drill 0.35)
  Top 0.152: T7.E 15.34,17.42 14.04,18.71 C19.P$1 13.96,18.79 12.9,19.86 12.9,20.16 R19.P$2 12.82,20.24 v8.4,24.66 | v7.56,36.77 8.48,37.69 9.16,37.69 IC2.3
  Bottom 0.152: v7.56,36.77 7.56,36.24 5.89,34.56 5.89,32.36 8.4,29.84 v8.4,24.66
S8  (via drill 0.35)
  Top 0.152: T8.E 25.85,9.72 24.63,9.72 24.02,10.33 C20.P$1 23.95,10.41 23.34,10.41 22.58,11.17 R20.P$2 22.5,11.25 22.5,12.62 17.77,17.34 17.09,17.34 13.28,21.15 v13.28,24.28 | v11.15,33.57 10.69,33.57 8.17,36.09 8.17,36.7 8.48,37 9.16,37 IC2.2
  Bottom 0.152: v11.15,33.57 11.15,32.89 12.21,31.82 12.21,25.34 v13.28,24.28
S9  (via drill 0.35)
  Top 0.152: 35.61,6.29 34.84,6.29 R21.P$2 | 35.61,6.29 36.44,6.29 C21.P$1 36.44,6.22 38.73,6.22 T9.E | v7.34,38.37 6.04,37.08 3.37,37.08 IC2.23 | v10.54,37 v10.54,38.37 | v35.61,8.89 v34.23,10.26 | 35.61,6.29 v35.61,7.06
  Bottom 0.152: v10.54,38.37 v7.34,38.37 | v10.54,37 10.54,33.04 11.91,31.67 11.91,24.73 12.97,23.67 16.56,23.67 29.97,10.26 v34.23,10.26 | v35.61,7.06 v35.61,8.89
S10  (via drill 0.35)
  Top 0.152: T10.E 51.84,8.05 50.62,8.05 49.93,7.36 C22.P$1 49.86,7.28 48.87,7.28 48.26,6.67 R22.P$2 48.18,6.67 47.8,7.06 v44.83,7.06 | v4.59,38.37 4.59,38.3 4.06,37.77 3.37,37.77 IC2.22 | v4.59,32.89 4.59,32.2 3.91,31.52 3.91,28.01 26.84,5.08 40.1,5.08 v41.24,6.22
  Bottom 0.152: v4.59,38.37 4.29,38.37 3.53,37.61 3.53,34.72 4.59,33.65 v4.59,32.89 | v41.24,6.22 41.24,6.45 41.85,7.06 v44.83,7.06
S11  (via drill 0.35)
  Top 0.152: T11.E 62.66,15.44 62.43,15.44 61.28,14.3 C23.P$1 61.21,14.22 61.06,14.22 60.22,13.38 R23.P$2 60.14,13.3 58.69,11.86 v56.71,11.86 | v50.92,11.86 28.37,11.86 17.39,22.83 17.39,25.04 6.73,35.71 2.69,35.71 2.31,36.09 2.31,38.07 2.61,38.37 3.3,38.37 IC2.21
  Bottom 0.152: v56.71,11.86 v50.92,11.86
S12
  Top 0.152: T12.E 70.66,25.88 70.2,25.42 70.2,24.43 C24.P$1 70.12,24.35 69.44,23.67 69.44,22.91 R24.P$2 69.36,22.83 69.36,20.54 53.59,4.77 26.69,4.77 3.6,27.86 3.6,30.22 2,31.82 2,38.37 2.61,38.98 3.3,38.98 IC2.20
S13  (via drill 0.35)
  Top 0.152: T13.E 73.4,38.6 73.4,36.93 73.33,36.85 C25.P$1 73.25,36.77 73.25,35.25 73.17,35.17 R25.P$2 73.1,35.17 73.1,23.82 53.74,4.47 26.54,4.47 8.1,22.91 v7.64,22.91 | v4.74,39.29 4.36,39.67 3.37,39.67 IC2.19
  Bottom 0.152: v4.74,39.29 4.74,39.14 5.2,38.68 5.2,38.07 4.74,37.61 3.98,37.61 3.83,37.46 3.83,34.87 5.2,33.5 5.2,30.83 4.82,30.45 4.82,25.73 v7.64,22.91
S14  (via drill 0.35)
  Top 0.152: T14.E 72.03,50.72 72.03,49.73 72.79,48.97 C26.P$1 72.87,48.89 72.87,47.52 73.17,47.21 R26.P$2 73.25,47.14 74.09,46.3 74.09,24.35 53.89,4.16 26.39,4.16 9.47,21.08 v8.55,21.08 | v2,39.67 2.61,40.28 3.3,40.28 IC2.18
  Bottom 0.152: v2,39.67 2,33.88 1.85,33.73 1.85,32.43 2.15,32.13 2.15,31.21 4.52,28.85 4.52,25.12 v8.55,21.08
S15  (via drill 0.35)
  Top 0.152: R27.P$2 67,60.09 66.01,61.08 66.01,61.39 C27.P$1 65.93,61.46 64.79,62.61 64.64,62.61 T15.E 64.56,62.68 53.13,74.11 25.32,74.11 7.95,56.74 v7.49,56.74 | v6.5,43.71 6.42,43.71 5.13,42.41 5.13,42.11 4.06,41.04 3.37,41.04 IC2.17
  Bottom 0.152: v6.5,43.71 6.5,47.9 4.82,49.58 4.82,53.92 7.49,56.59 v7.49,56.74
S16  (via drill 0.35)
  Top 0.152: R28.P$2 56.18,69.46 55.57,69.46 54.66,70.38 C28.P$1 54.58,70.45 53.59,70.45 53.13,70.91 T16.E 53.06,70.99 52.98,71.06 v51.99,71.06 | v51,72.06 49.25,73.81 25.47,73.81 3.53,51.86 3.53,47.98 1.62,46.07 1.62,42.64 2.61,41.65 3.3,41.65 IC2.16
  Bottom 0.152: v51.99,71.06 v51,72.06